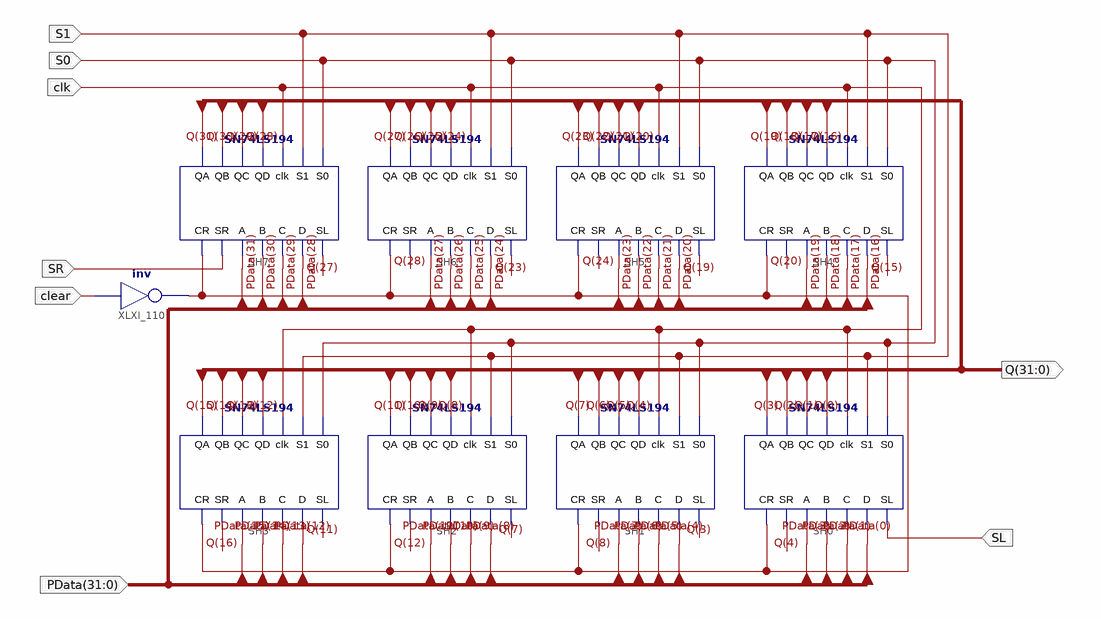
[diagram p0: schematic sheet 1]
// Xilinx ISE schematic Shift_32.sch (spartan3) as structural Verilog: 9 symbols, 8 ports
module Shift_32 (
  input  S1,
  input  S0,
  input  [31:0] PData,
  input  clk,
  input  clear,
  input  SR,
  input  SL,
  output [31:0] Q
);

  wire XLXN_201;

  SN74LS194 SH4 (
    .QA(Q[19]), .QB(Q[18]), .QC(Q[17]), .QD(Q[16]), .S1(S1), .clk(clk), .S0(S0), .CR(XLXN_201),
    .A(PData[19]), .SR(Q[20]), .B(PData[18]), .C(PData[17]), .D(PData[16]), .SL(Q[15]));
  SN74LS194 SH5 (
    .QA(Q[23]), .QB(Q[22]), .QC(Q[21]), .QD(Q[20]), .S1(S1), .clk(clk), .S0(S0), .CR(XLXN_201),
    .A(PData[23]), .SR(Q[24]), .B(PData[22]), .C(PData[21]), .D(PData[20]), .SL(Q[19]));
  SN74LS194 SH6 (
    .QA(Q[27]), .QB(Q[26]), .QC(Q[25]), .QD(Q[24]), .S1(S1), .clk(clk), .S0(S0), .CR(XLXN_201),
    .A(PData[27]), .SR(Q[28]), .B(PData[26]), .C(PData[25]), .D(PData[24]), .SL(Q[23]));
  SN74LS194 SH7 (
    .QA(Q[31]), .QB(Q[30]), .QC(Q[29]), .QD(Q[28]), .S1(S1), .clk(clk), .S0(S0), .CR(XLXN_201),
    .A(PData[31]), .SR(SR), .B(PData[30]), .C(PData[29]), .D(PData[28]), .SL(Q[27]));
  SN74LS194 SH3 (
    .QA(Q[15]), .QB(Q[14]), .QC(Q[13]), .QD(Q[12]), .S1(S1), .clk(clk), .S0(S0), .CR(XLXN_201),
    .A(PData[15]), .SR(Q[16]), .B(PData[14]), .C(PData[13]), .D(PData[12]), .SL(Q[11]));
  SN74LS194 SH0 (
    .QA(Q[3]), .QB(Q[2]), .QC(Q[1]), .QD(Q[0]), .S1(S1), .clk(clk), .S0(S0), .CR(XLXN_201), .A(PData[3]),
    .SR(Q[4]), .B(PData[2]), .C(PData[1]), .D(PData[0]), .SL(SL));
  SN74LS194 SH1 (
    .QA(Q[7]), .QB(Q[6]), .QC(Q[5]), .QD(Q[4]), .S1(S1), .clk(clk), .S0(S0), .CR(XLXN_201), .A(PData[7]),
    .SR(Q[8]), .B(PData[6]), .C(PData[5]), .D(PData[4]), .SL(Q[3]));
  SN74LS194 SH2 (
    .QA(Q[11]), .QB(Q[10]), .QC(Q[9]), .QD(Q[8]), .S1(S1), .clk(clk), .S0(S0), .CR(XLXN_201), .A(PData[11]),
    .SR(Q[12]), .B(PData[10]), .C(PData[9]), .D(PData[8]), .SL(Q[7]));
  not XLXI_110 (XLXN_201, clear);
endmodule
